# Altium schematic sheet Column.SchDoc
size 420 x 297 mm; Address1: Address1; Address2: Address2; Address3: Address3; Address4: Address4; DocumentNumber: *Э3; SheetNumber: 7; SheetTotal: 12; DocumentType: Схема электрическая *
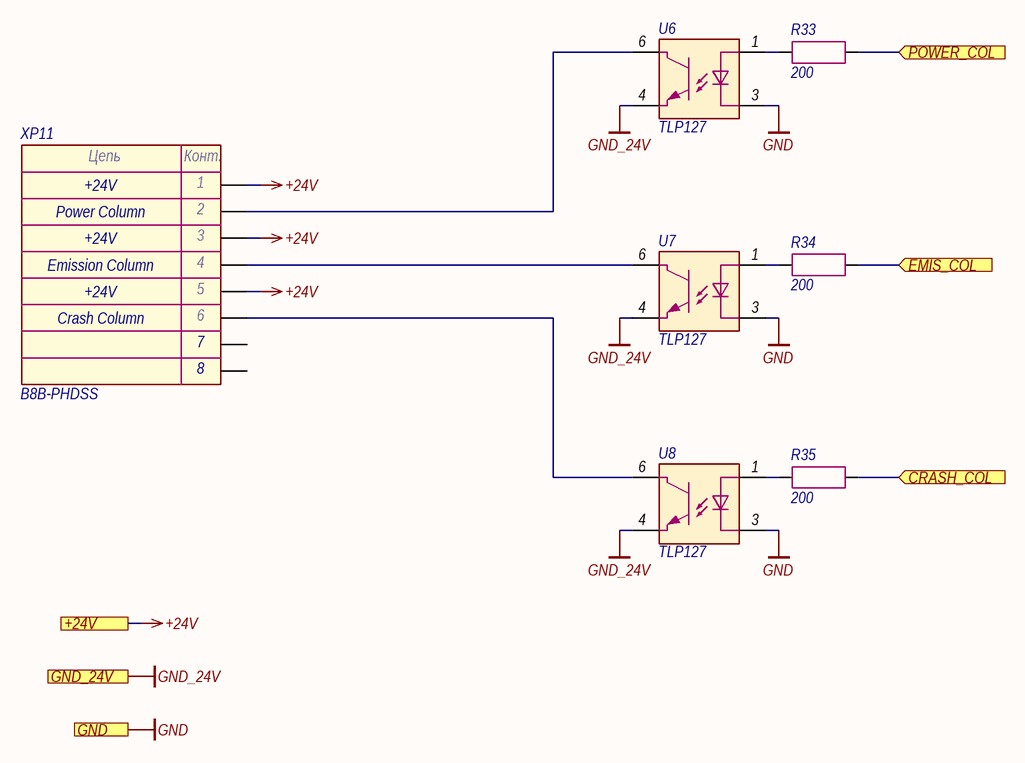
[diagram p0: Column.SchDoc]

## Parts
R33  200  [RES_0603]
R34  200  [RES_0603]
R35  200  [RES_0603]
U6  TLP127  [11-4C1]
U7  TLP127  [11-4C1]
U8  TLP127  [11-4C1]
XP11  B8B-PHDSS  [B8B-PHDSS]

## Ports
+24V (see Main[1B], Bus[1D], Button[1C], Flow_sensor[2C], Hardwiring[3C], Indication[1C]), CRASH_COL (in, see Main[2B]), EMIS_COL (in, see Main[2B]), GND (see Main[1B], Bus[1D], Button[1D], Ethernet[3D], Fiber_interlock[2C], Flow_sensor[2C], Guide_laser[1C], Hardwiring[3D], Indication[1C]), GND_24V (see Main[1B], Bus[1D], Button[1D], Flow_sensor[2C], Hardwiring[3C], Indication[1C]), POWER_COL (in, see Main[2B])

## Nets
+24V: XP11.1 XP11.3 XP11.5 ; port +24V
GND: U6.3 U7.3 U8.3 ; port GND
GND_24V: U6.4 U7.4 U8.4 ; port GND_24V
CRASH_COL: R35.2 ; port CRASH_COL
EMIS_COL: R34.2 ; port EMIS_COL
POWER_COL: R33.2 ; port POWER_COL
NetR33_1: R33.1 U6.1
NetR34_1: R34.1 U7.1
NetR35_1: R35.1 U8.1
NetU6_6: U6.6 XP11.2
NetU7_6: U7.6 XP11.4
NetU8_6: U8.6 XP11.6

Not connected (* = marked no-connect by the designer): XP11 7 8

## Notes on the sheet
- Power Column
- +24V
- Emission Column
- Crash Column
- Подп. и дата
- Инв. № дубл.
- Взам. инв. №
- Инв. № подл.
- Изм.
- Лист
- № докум.
- Подп.
- Дата
- Копировал
- Формат А3
- (in symbol Connector-8) Цепь; Конт.

## Library data of the parts
R33-R35 = Resistor: Manufacturer: Yageo; Model: RC0603FR-07200RL; Value: 200; Document: *
U6-U8 = TLP127: Manufacturer: Toshiba; Model: TLP127; Document: *
XP11 = Connector-8: Manufacturer: JST; Model: B8B-PHDSS; Document: *